# Altium project Mother_Board.PrjPcb
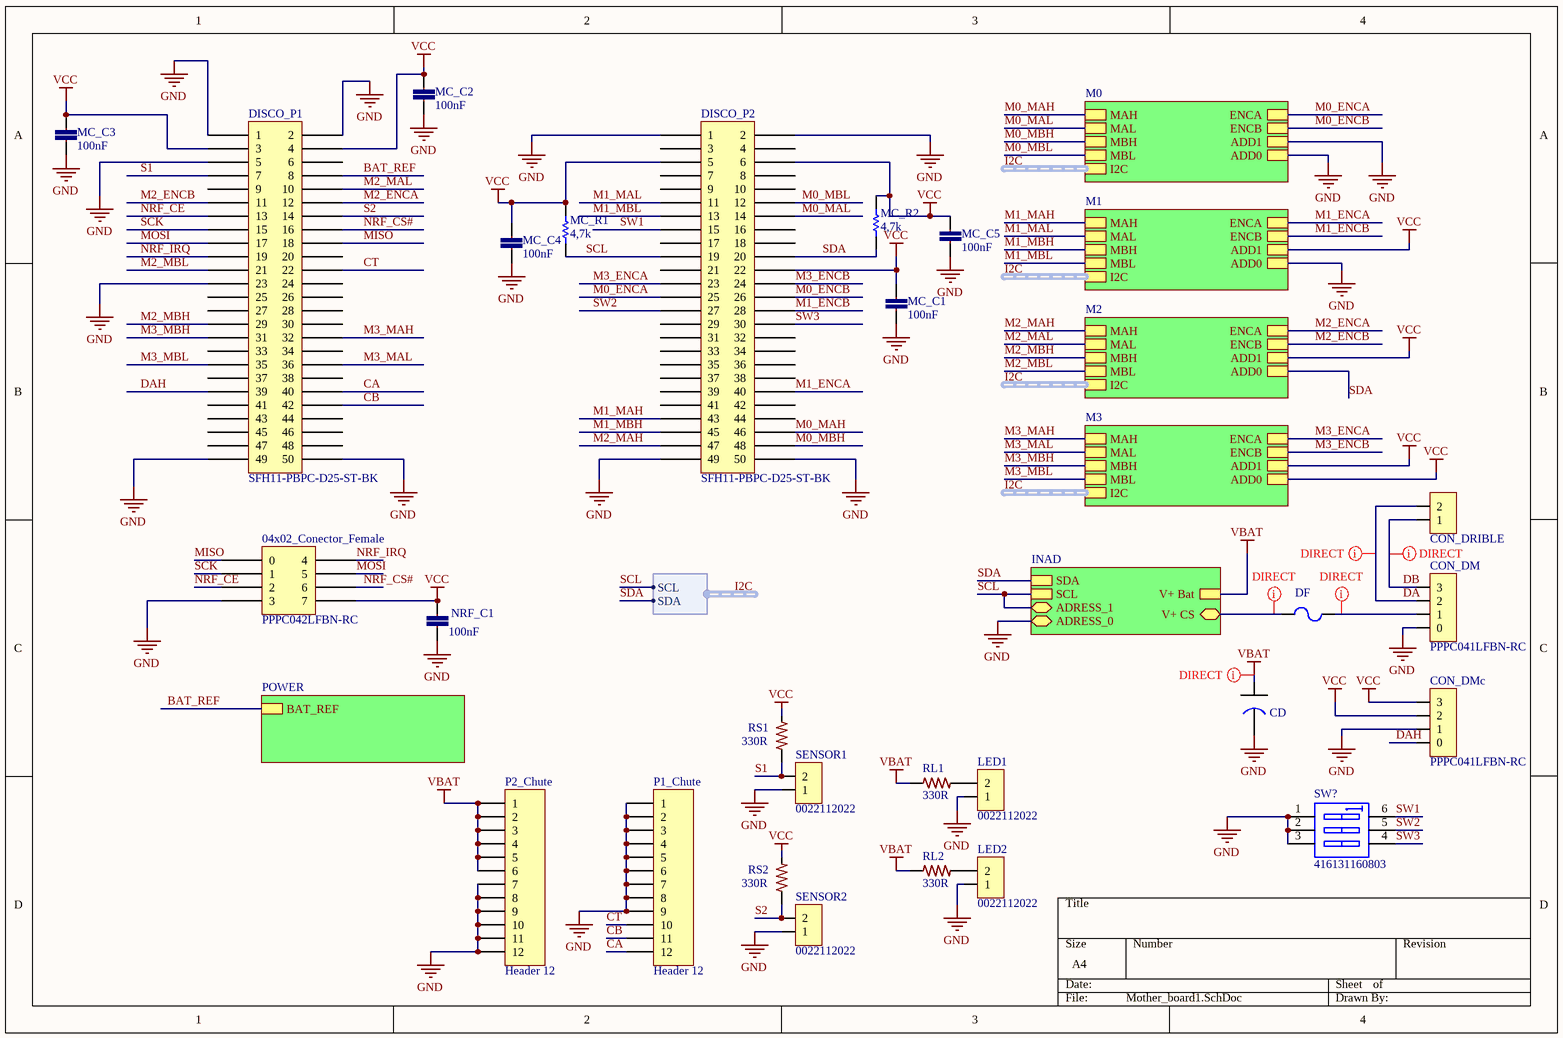
[diagram p0: Mother_board1.SchDoc]
4 sheets, 90 parts. Net scope: hierarchical (ports join the sheet entries above them; power ports are global).
Board file: Mother_board06.PcbDoc
Sheets:
  Mother_board1.SchDoc
    M0 = MOTORES.SchDoc
      INA = INA220.SchDoc
    POWER = POWER.SchDoc
    M1 = MOTORES.SchDoc
      INA = INA220.SchDoc
    M2 = MOTORES.SchDoc
      INA = INA220.SchDoc
    M3 = MOTORES.SchDoc
      INA = INA220.SchDoc
    INAD = INA220.SchDoc

## Sheet Mother_board1.SchDoc
size A4

### Parts
04x02_Conector_Female  PPPC042LFBN-RC  [04x02_Conector_Female]
CD  EEE-FK1C681GP  [EEE-FK1C681GP]  (value not drawn)
CON_DM  PPPC041LFBN-RC  [04x01_Conector_Female - duplicate]
CON_DMc  PPPC041LFBN-RC  [04x01_Conector_Female - duplicate]
CON_DRIBLE  0022112022  [02x01_Conector_Male]  (value not drawn)
DF  MF-MSMF250/16X  [RESC4632X16N]  (value not drawn)
DISCO_P1  SFH11-PBPC-D25-ST-BK  [25x02_Conector_Female]
DISCO_P2  SFH11-PBPC-D25-ST-BK  [25x02_Conector_Female]
LED1  0022112022  [02x01_Conector_Male]
LED2  0022112022  [02x01_Conector_Male]
MC_C1  100nF  [0402-CAP]
MC_C2  100nF  [0402-CAP]
MC_C3  100nF  [0402-CAP]
MC_C4  100nF  [0402-CAP]
MC_C5  100nF  [0402-CAP]
MC_R1  4,7k  [0402]
MC_R2  4,7k  [0402]
NRF_C1  100nF  [0402-CAP]
P1_Chute  Header 12  [HDR1X12]
P2_Chute  Header 12  [HDR1X12]
RL1  330R  [0402-RES-HD]
RL2  330R  [0402-RES-HD]
RS1  330R  [0402-RES-HD]
RS2  330R  [0402-RES-HD]
SENSOR1  0022112022  [02x01_Conector_Male]
SENSOR2  0022112022  [02x01_Conector_Male]
SW?  416131160803  [416131160803]

### Sub-sheets
INAD = INA220.SchDoc: V+ Bat, SDA, SCL, ADRESS_1, ADRESS_0, V+ CS
M0 = MOTORES.SchDoc: MBH, MAH, MBL, MAL, I2C (harness I2C), ENCA, ENCB, ADD1, ADD0
M1 = MOTORES.SchDoc: MBH, MAH, MBL, MAL, I2C (harness I2C), ENCA, ENCB, ADD1, ADD0
M2 = MOTORES.SchDoc: MBH, MAH, MBL, MAL, I2C (harness I2C), ENCA, ENCB, ADD1, ADD0
M3 = MOTORES.SchDoc: MBH, MAH, MBL, MAL, I2C (harness I2C), ENCA, ENCB, ADD1, ADD0
POWER = POWER.SchDoc: BAT_REF

### Harnesses
I2C: SCL, SDA

### Nets
GND: 04x02_Conector_Female.3 CD.2 CON_DM.0 CON_DMc.1 DISCO_P1.1 DISCO_P1.2 DISCO_P1.5 DISCO_P1.23 DISCO_P1.49 DISCO_P1.50 DISCO_P2.1 DISCO_P2.2 DISCO_P2.49 DISCO_P2.50 LED1.1 LED2.1 MC_C1.1 MC_C2.1 MC_C3.2 MC_C4.1 MC_C5.1 NRF_C1.2 P1_Chute.1 P1_Chute.2 P1_Chute.3 P1_Chute.4 P1_Chute.5 P1_Chute.6 P1_Chute.7 P1_Chute.8 P1_Chute.9 P2_Chute.7 P2_Chute.8 P2_Chute.9 P2_Chute.10 P2_Chute.11 P2_Chute.12 SENSOR1.1 SENSOR2.1 SW?.1 SW?.2 SW?.3 ; sheet M0/ADD1, sheet M0/ADD0, sheet M1/ADD0, sheet INAD/ADRESS_0
VBAT: CD.1 P2_Chute.1 P2_Chute.2 P2_Chute.3 P2_Chute.4 P2_Chute.5 P2_Chute.6 RL1.1 RL2.1 ; sheet INAD/V+ Bat  [project net V+ Bat]
VCC: 04x02_Conector_Female.7 CON_DMc.2 CON_DMc.3 DISCO_P1.3 DISCO_P1.4 DISCO_P2.5 DISCO_P2.6 DISCO_P2.22 MC_C1.2 MC_C2.2 MC_C3.1 MC_C4.2 MC_C5.2 MC_R1.2 MC_R2.2 NRF_C1.1 RS1.2 RS2.2 ; sheet M1/ADD1, sheet M2/ADD1, sheet M3/ADD1, sheet M3/ADD0
BAT_REF: DISCO_P1.8 ; sheet POWER/BAT_REF
CA: DISCO_P1.40 P1_Chute.12
CB: DISCO_P1.42 P1_Chute.11
CT: DISCO_P1.22 P1_Chute.10
DA: CON_DM.2 CON_DRIBLE.2
DAH: CON_DMc.0 DISCO_P1.39
DB: CON_DM.3 CON_DRIBLE.1
M0_ENCA: DISCO_P2.25 ; sheet M0/ENCA
M0_ENCB: DISCO_P2.26 ; sheet M0/ENCB
M0_MAH: DISCO_P2.46 ; sheet M0/MAH
M0_MAL: DISCO_P2.14 ; sheet M0/MAL
M0_MBH: DISCO_P2.48 ; sheet M0/MBH
M0_MBL: DISCO_P2.12 ; sheet M0/MBL
M1_ENCA: DISCO_P2.40 ; sheet M1/ENCA
M1_ENCB: DISCO_P2.28 ; sheet M1/ENCB
M1_MAH: DISCO_P2.43 ; sheet M1/MAH
M1_MAL: DISCO_P2.11 ; sheet M1/MAL
M1_MBH: DISCO_P2.45 ; sheet M1/MBH
M1_MBL: DISCO_P2.13 ; sheet M1/MBL
M2_ENCA: DISCO_P1.12 ; sheet M2/ENCA
M2_ENCB: DISCO_P1.11 ; sheet M2/ENCB
M2_MAH: DISCO_P2.47 ; sheet M2/MAH
M2_MAL: DISCO_P1.10 ; sheet M2/MAL
M2_MBH: DISCO_P1.29 ; sheet M2/MBH
M2_MBL: DISCO_P1.21 ; sheet M2/MBL
M3_ENCA: DISCO_P2.23 ; sheet M3/ENCA
M3_ENCB: DISCO_P2.24 ; sheet M3/ENCB
M3_MAH: DISCO_P1.32 ; sheet M3/MAH
M3_MAL: DISCO_P1.36 ; sheet M3/MAL
M3_MBH: DISCO_P1.31 ; sheet M3/MBH
M3_MBL: DISCO_P1.35 ; sheet M3/MBL
MISO: 04x02_Conector_Female.0 DISCO_P1.18
MOSI: 04x02_Conector_Female.5 DISCO_P1.17
NRF_CE: 04x02_Conector_Female.2 DISCO_P1.13
NRF_CS#: 04x02_Conector_Female.6 DISCO_P1.16
NRF_IRQ: 04x02_Conector_Female.4 DISCO_P1.19
S1: DISCO_P1.7 RS1.1 SENSOR1.2
S2: DISCO_P1.14 RS2.1 SENSOR2.2
SCK: 04x02_Conector_Female.1 DISCO_P1.15
SCL: DISCO_P2.19 MC_R1.1 ; sheet INAD/SCL, sheet INAD/ADRESS_1, sheet M0/I2C.SCL  [project net I2C.SCL]
SDA: DISCO_P2.20 MC_R2.1 ; sheet M2/ADD0, sheet INAD/SDA, sheet M0/I2C.SDA  [project net I2C.SDA]
SW1: DISCO_P2.15 SW?.6
SW2: DISCO_P2.27 SW?.5
SW3: DISCO_P2.30 SW?.4
NetCON_DM_1: CON_DM.1 DF.1
NetDF_2: DF.2 ; sheet INAD/V+ CS
NetLED1_2: LED1.2 RL1.2
NetLED2_2: LED2.2 RL2.2

Not connected (* = marked no-connect by the designer): DISCO_P1 6 9 20 24 25 26 27 28 30 33 34 37 38 41 43 44 45 46 47 48; DISCO_P2 3 4 7 8 9 10 16 17 18 21 29 31 32 33 34 35 36 37 38 39 41 42 44

### Buses and harness runs
harness I2C = sheet M0/I2C
harness I2C = sheet M1/I2C
harness I2C = sheet M2/I2C
harness I2C = sheet M3/I2C

### Layout directives
net class DIRECT: DA, DB, NetCON_DM_1, NetDF_2, V+ Bat

### Library data of the parts
04x02_Conector_Female = 04x02_Conector_Female: 8 Position Header Connector 0.100" (2.54mm) Through Hole Gold
CD = CAP AL 680UF/16V: Aluminum Electrolytic Capacitors - SMD Al Lytic Cap SMT FK Series 105C
CON_DM CON_DMc = 04x01_Conector_Female-SCH: 4 Position Header Connector 0.100" (2.54mm) Through Hole Gold
CON_DRIBLE LED1 LED2 SENSOR1 SENSOR2 = 02x01_Conector_Male: CONN HEADER 2POS .100 VERT GOLD
DF = MF-MSMF250/16X-01.A.1: PTC RESETTABLE .30A 30V 1812
DISCO_P1 DISCO_P2 = 25x02_Conector_Female: 50 Position Header Connector 0.100" (2.54mm) Through Hole Gold
MC_C1-MC_C5 NRF_C1 = CC0402-100nF-A.12: CAP CER 0.1UF 10V 20% X5R 0402; Part No: VJ0402V104ZXQPBC; Cod EMS: 05.281.006.133; Value: 100n
MC_R1 MC_R2 = Res1: Resistor; Published: 8-Jun-2000; LatestRevisionDate: 17-Jul-2002; LatestRevisionNote: Re-released for DXP Platform.; PackageReference: AXIAL-0.3; Publisher: Altium Limited; PackageDescription: Axial Device, Thru-Hole; 2 Leads; 0.3 in Pin Spacing; Value: 4,7K
P1_Chute P2_Chute = Header 12: Header, 12-Pin; LatestRevisionDate: 17-Jul-2002; LatestRevisionNote: Re-released for DXP Platform.; Publisher: Altium Limited
RL1 RL2 RS1 RS2 = R0402-330R-7: RES 330 OHM 1/10W 1% 0402 SMD; Part No: ERJ-2RKF3300X; Value: 330; Cod EMS: 05.280.029.506; Family Description: RESISTOR FILME ESPESSO 10R-1M / 1/10W / 1% / 0402. P/N: ERJ-2RKF....X – PANASONIC ELECTRONIC COMPONENTS.; Family: ERJ-2RKF....X
SW? = CMP-1433-00003-1: WS-DISV 1.27 mm small compact SMD Dip Switch with top tape; Manufacturer: Wuerth Elektronik; NoPins: 06; ComponentLink2Description: Datasheet; ComponentLink1URL: http://www.we-online.com; PackageReference: 416131160803; ComponentLink1Description: Manufacturer URL; PartNumber: 416131160803; ComponentLink2URL: http://katalog.we-online.de/em/datasheet/4161311608xx.pdf

## Sheet MOTORES.SchDoc
size A4
Used 4 times, as channels M0, M1, M2, M3. Parts and nets are listed once, with the designators drawn on the sheet.
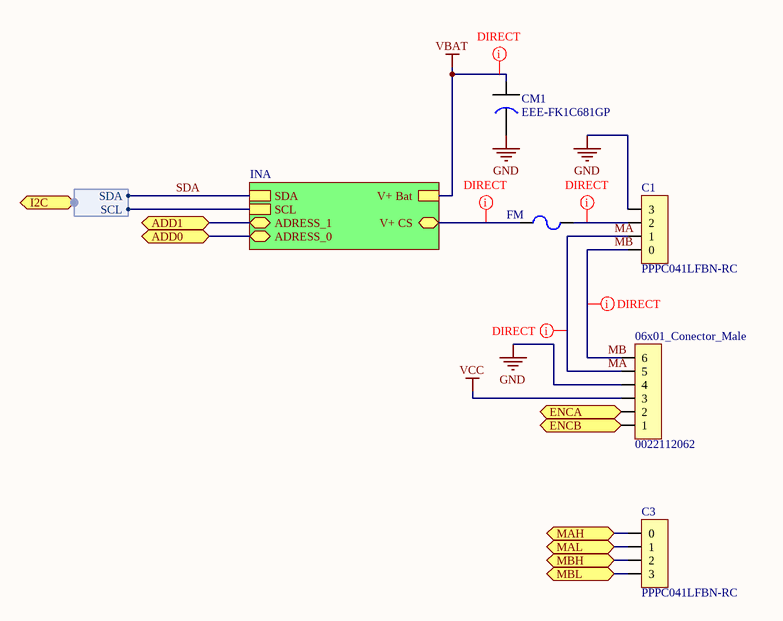
[diagram p1: MOTORES.SchDoc]

### Parts
06x01_Conector_Male  0022112062  [06x01_Conector_Male]
C1  PPPC041LFBN-RC  [04x01_Conector_Female]
C3  PPPC041LFBN-RC  [04x01_Conector_Female]
CM1  EEE-FK1C681GP  [EEE-FK1C681GP]
FM  MF-MSMF250/16X  [RESC4632X16N]  (value not drawn)

### Sub-sheets
INA = INA220.SchDoc: V+ Bat, SDA, SCL, ADRESS_1, ADRESS_0, V+ CS

### Ports
ADD0, ADD1, ENCA, ENCB, I2C (harness I2C), MAH, MAL, MBH, MBL

### Harnesses
I2C: SDA, SCL

### Nets
GND: 06x01_Conector_Male.4 C1.3 CM1.2
VBAT: CM1.1 ; sheet INA/V+ Bat
VCC: 06x01_Conector_Male.3
ADD0: port ADD0, sheet INA/ADRESS_0
ADD1: port ADD1, sheet INA/ADRESS_1
ENCA: 06x01_Conector_Male.2 ; port ENCA
ENCB: 06x01_Conector_Male.1 ; port ENCB
MA: 06x01_Conector_Male.5 C1.1
MAH: C3.0 ; port MAH
MAL: C3.1 ; port MAL
MB: 06x01_Conector_Male.6 C1.0
MBH: C3.2 ; port MBH
MBL: C3.3 ; port MBL
SDA: sheet INA/SDA, port I2C.SDA
NetC1_2: C1.2 FM.1
NetFM_2: FM.2 ; sheet INA/V+ CS
(unnamed): sheet INA/SCL, port I2C.SCL

### Channels
M0: designators end in _M0; ports ADD0=GND ADD1=GND ENCA=M0_ENCA ENCB=M0_ENCB MAH=M0_MAH MAL=M0_MAL MBH=M0_MBH MBL=M0_MBL
M1: designators end in _M1; ports ADD0=GND ADD1=VCC ENCA=M1_ENCA ENCB=M1_ENCB MAH=M1_MAH MAL=M1_MAL MBH=M1_MBH MBL=M1_MBL
M2: designators end in _M2; ports ADD0=I2C.SDA ADD1=VCC ENCA=M2_ENCA ENCB=M2_ENCB MAH=M2_MAH MAL=M2_MAL MBH=M2_MBH MBL=M2_MBL
M3: designators end in _M3; ports ADD0=VCC ADD1=VCC ENCA=M3_ENCA ENCB=M3_ENCB MAH=M3_MAH MAL=M3_MAL MBH=M3_MBH MBL=M3_MBL

### Layout directives
net class DIRECT: MA_M0, MB_M0, NetC1_M0_2, NetFM_M0_2, V+ Bat

### Library data of the parts
06x01_Conector_Male = 06x01_Conector_Male: CONN HEADER 6POS .100 VERT GOLD
C1 C3 = 04x01_Conector_Female-SCH: as CON_DM on sheet Mother_board1
CM1 = CAP AL 680UF/16V: as CD on sheet Mother_board1
FM = MF-MSMF250/16X-01.A.1: PTC RESETTABLE .30A 30V 1812

## Sheet INA220.SchDoc
size A4; Organization1: VINCULADA AO EXÉRCITO BRASILEIRO; Organization2: FÁBRICA DE MATERIAL DE; Organization3: COMUNICAÇÕES E ELETRÔNICA; Organization0: INDÚSTRIA DE MATERIAL BÉLICO DO BRASIL
Used 5 times, as channels M0/INA, M1/INA, M2/INA, M3/INA, INAD. Parts and nets are listed once, with the designators drawn on the sheet.
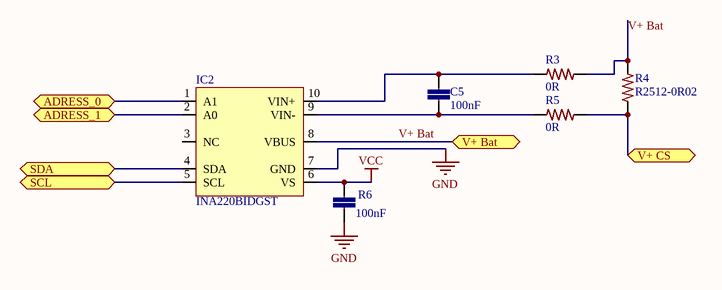
[diagram p2: INA220.SchDoc]

### Parts
C5  100nF  [0402-CAP]
IC2  INA220BIDGST  [TSSOP10]
R3  0R  [0402-RES-HD]
R4  R2512-0R02  [2512-RES-HD]
R5  0R  [0402-RES-HD]
R6  100nF  [0402-CAP]

### Ports
ADRESS_0, ADRESS_1, SCL, SDA, V+ Bat, V+ CS

### Nets
GND: IC2.7(GND) R6.2
VCC: IC2.6(VS) R6.1
ADRESS_0: IC2.1(A1) ; port ADRESS_0
ADRESS_1: IC2.2(A0) ; port ADRESS_1
SCL: IC2.5(SCL) ; port SCL
SDA: IC2.4(SDA) ; port SDA
V+ Bat: IC2.8(VBUS) R3.2 R4.2 ; port V+ Bat
V+ CS: R4.1 R5.2 ; port V+ CS
NetC5_1: C5.1 IC2.10(VIN+) R3.1
NetC5_2: C5.2 IC2.9(VIN-) R5.1

Not connected (* = marked no-connect by the designer): IC2 3(NC)

### Channels
M0/INA: designators end in _M0_INA; ports ADRESS_0=GND ADRESS_1=GND SCL=I2C.SCL SDA=I2C.SDA V+ Bat=V+ Bat V+ CS=NetFM_M0_2
M1/INA: designators end in _M1_INA; ports ADRESS_0=GND ADRESS_1=VCC SCL=I2C.SCL SDA=I2C.SDA V+ Bat=V+ Bat V+ CS=NetFM_M1_2
M2/INA: designators end in _M2_INA; ports ADRESS_0=I2C.SDA ADRESS_1=VCC SCL=I2C.SCL SDA=I2C.SDA V+ Bat=V+ Bat V+ CS=NetFM_M2_2
M3/INA: designators end in _M3_INA; ports ADRESS_0=VCC ADRESS_1=VCC SCL=I2C.SCL SDA=I2C.SDA V+ Bat=V+ Bat V+ CS=NetFM_M3_2
INAD: designators end in _INAD; ports ADRESS_0=GND ADRESS_1=I2C.SCL SCL=I2C.SCL SDA=I2C.SDA V+ Bat=V+ Bat V+ CS=NetDF_2

### Notes on the sheet
- USADO EQUIP.:
- DATA:
- ENG:
- HORA:
- APROV._______
- REV:
- TÍTULO:
- FOLHA:
- /
- FORMATO:
- A4
- CÓDIGO:
- ESTOQUE:

### Library data of the parts
C5 R6 = CC0402-100nF-A.12: as MC_C1 on sheet Mother_board1
IC2 = INA220BIDGST-3: IC MONITOR PWR/CURR BIDIR 10MSOP; Cod EMS: 05.284.001.527; Part No: INA220BIDGST
R3 R5 = R0402-0R-7: RES 0.0 OHM 1/16W JUMP 0402 SMD; Part No: CRCW04020000Z0ED; Cod EMS: 05.280.029.528; Value: 0
R4 = R2512-0R02-4: RES .02 OHM 2W 1% 2512 SMD; Part No: WSL2512R0200FEA18; Cod EMS: 05.280.029.529; Value: 0.02; Family Description: RESISTOR SENTIDO DE CORRENTE 0,010R-0,040R/ 2W / 1% / 2512 P/N: WSL2512.....FEA18 – VISHAY DALE.; Family: WSL2512.....FEA18

## Sheet POWER.SchDoc
size A4
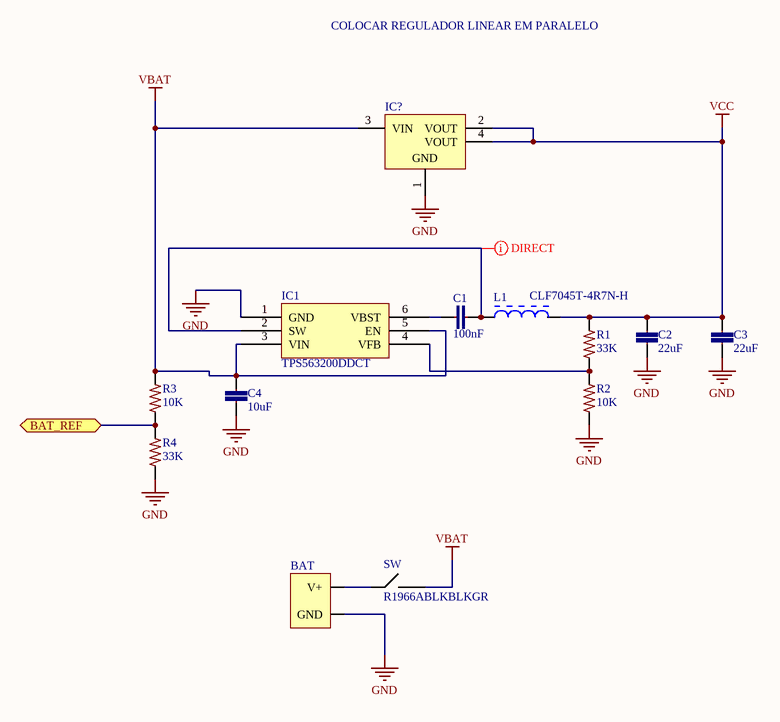
[diagram p3: POWER.SchDoc]

### Parts
BAT  XT60  [BATTERY_CONECTO-PCB]  (value not drawn)
C1  100nF  [0402-CAP]
C2  22uF  [1206-CAP]
C3  22uF  [1206-CAP]
C4  10uF  [1210-CAP]
IC1  TPS563200DDCT  [SOT95P280X110-6N]
IC?  LD1117S33CTR  [SOT-223_N]  (value not drawn)
L1  CLF7045T-4R7N-H  [CLF7045T]
R1  33K  [0402-RES-HD]
R2  10K  [0402-RES-HD]
R3  10K  [0402-RES-HD]
R4  33K  [0402-RES-HD]
SW  R1966ABLKBLKGR  [R1966AB-PCB]

### Ports
BAT_REF

### Nets
GND: BAT.1(GND) C2.1 C3.1 C4.1 IC1.1(GND) IC?.1(GND) R2.1 R4.1
VBAT: C4.2 IC1.3(VIN) IC1.5(EN) IC?.3(VIN) R3.2 SW.1  [project net V+ Bat]
VCC: C2.2 C3.2 IC?.2(VOUT) IC?.4(VOUT) L1.2 R1.2
BAT_REF: R3.1 R4.2 ; port BAT_REF
NetBAT_0: BAT.0(V+) SW.0
NetC1_1: C1.1 IC1.6(VBST)
NetC1_2: C1.2 IC1.2(SW) L1.1
NetIC1_4: IC1.4(VFB) R1.1 R2.2

### Layout directives
net class DIRECT: NetC1_2

### Notes on the sheet
- COLOCAR REGULADOR LINEAR EM PARALELO

### Library data of the parts
BAT = BATTERY_CONNECTOR: XT60 PRT-10474
C1 = CC0402-100nF-50v-A.3: CAP CER 0.1UF 50V 10% X7R 0402; Part No: C1005X7R1H104K050BB; Value: 100n; Cod EMS: 05.281.019.021
C2 C3 = CC1206-22uF-6.3V-1: CAP CER 22UF 6.3V 20% X5R 1206; Part No: C3216X5R0J226M085AC; Value: 22u; Rule: UNIONINDEX{}0[]RULEKIND{}PolygonConnect[]NETSCOPE{}AnyNet[]LAYERKIND{}SameLayer[]NAME{}Schematic Polygon Connect Style[]CONNECTSTYLE{}Direct[]RELIEFCONDUCTORWIDTH{}10mil[]RELIEFENTRIES{}4[]POLYGONRELIEFANGLE{}45 Angle[]AIRGAPWIDTH{}10mil[]UNIT{}Imperial[]PcbType{}ProtelPcb
C4 = CC1210-10uF-6: CAP CER 10UF 50V 20% X5R 1210; Part No: UMK325BJ106MM; value: 10u; Cod EMS: 05.281.019.522
IC1 = TPS563200DDCT-01.A.2: IC REG BUCK ADJ 3A SYNC 6SOT
IC? = CMP-0244-00307-1: Fixed Low Drop Positive Voltage Regulator, 3.3V, 4-Pin SOT-223, Tape and Reel; ComponentLink1URL: http://www.st.com; PackageVersion: 2010; ComponentLink1Description: Manufacturer URL; DatasheetVersion: 1/11/2011; ComponentLink2URL: http://www.st.com/internet/com/TECHNICAL_RESOURCES/TECHNICAL_LITERATURE/DATASHEET/CD00000544.pdf; PackageReference: SOT-223; ComponentLink2Description: Datasheet; PackageDescription: 4-Pin SOT-223 Package, 6.5 x 3.5 mm Body, 2.3 mm Pitch, 7 mm Lead Span
L1 = CLF7045T-4R7N-H-2: FIXED IND 4.7UH 4.1A 20 MOHM SMD; Family Description: INDUTORES FIXOS 7,2x6,9mm TDK CLF7045T -45 A 125oC; Rule: UNIONINDEX{}0[]RULEKIND{}PolygonConnect[]NETSCOPE{}AnyNet[]LAYERKIND{}SameLayer[]NAME{}Schematic Polygon Connect Style[]CONNECTSTYLE{}Direct[]RELIEFCONDUCTORWIDTH{}10mil[]RELIEFENTRIES{}4[]POLYGONRELIEFANGLE{}45 Angle[]AIRGAPWIDTH{}10mil[]UNIT{}Imperial[]PcbType{}ProtelPcb; Part No: CLF7045T-4R7N-H; Family: CLF7045T
R1 = R0402-33K-7: RES 33K OHM 1/10W 1% 0402 SMD; Part No: ERJ-2RKF3302X; Family Description: RESISTOR FILME ESPESSO 10R-1M / 1/10W / 1% / 0402. P/N: ERJ-2RKF....X – PANASONIC ELECTRONIC COMPONENTS.; Cod EMS: 05.280.029.535; Value: 33K; Family: ERJ-2RKF....X
R2 R3 = R0402-10K-10: RES 10K OHM 1/10W 1% 0402 SMD; Part No: ERJ-2RKF1002X; Cod EMS: 05.280.029.525; Family Description: RESISTOR FILME ESPESSO 10R-1M / 1/10W / 1% / 0402. P/N: ERJ-2RKF....X – PANASONIC ELECTRONIC COMPONENTS.; Value: 10K; Family: ERJ-2RKF....X
R4 = R0402-33K-7: RES 33K OHM 1/10W 1% 0402 SMD; Part No: ERJ-2RKF3302X; Cod EMS: 05.280.029.535; Family Description: RESISTOR FILME ESPESSO 10R-1M / 1/10W / 1% / 0402. P/N: ERJ-2RKF....X – PANASONIC ELECTRONIC COMPONENTS.; Value: 33K; Family: ERJ-2RKF....X
SW = Rocker Switch: SWITCH ROCKER SPST 15A 125V

## Nets that join several sheets
GND: Mother_board1 (42 pins), M0 (06x01_Conector_Male_M0.4 C1_M0.3 CM1_M0.2), M0/INA (IC2_M0_INA.1 IC2_M0_INA.2 IC2_M0_INA.7 R6_M0_INA.2), POWER (8 pins), M1 (06x01_Conector_Male_M1.4 C1_M1.3 CM1_M1.2), M1/INA (IC2_M1_INA.1 IC2_M1_INA.7 R6_M1_INA.2), M2 (06x01_Conector_Male_M2.4 C1_M2.3 CM1_M2.2), M2/INA (IC2_M2_INA.7 R6_M2_INA.2), M3 (06x01_Conector_Male_M3.4 C1_M3.3 CM1_M3.2), M3/INA (IC2_M3_INA.7 R6_M3_INA.2), INAD (IC2_INAD.1 IC2_INAD.7 R6_INAD.2)
V+ Bat: Mother_board1 (9 pins), M0 (CM1_M0.1), M0/INA (IC2_M0_INA.8 R3_M0_INA.2 R4_M0_INA.2), POWER (6 pins), M1 (CM1_M1.1), M1/INA (IC2_M1_INA.8 R3_M1_INA.2 R4_M1_INA.2), M2 (CM1_M2.1), M2/INA (IC2_M2_INA.8 R3_M2_INA.2 R4_M2_INA.2), M3 (CM1_M3.1), M3/INA (IC2_M3_INA.8 R3_M3_INA.2 R4_M3_INA.2), INAD (IC2_INAD.8 R3_INAD.2 R4_INAD.2)
VCC: Mother_board1 (18 pins), M0 (06x01_Conector_Male_M0.3), M0/INA (IC2_M0_INA.6 R6_M0_INA.1), POWER (6 pins), M1 (06x01_Conector_Male_M1.3), M1/INA (IC2_M1_INA.2 IC2_M1_INA.6 R6_M1_INA.1), M2 (06x01_Conector_Male_M2.3), M2/INA (IC2_M2_INA.2 IC2_M2_INA.6 R6_M2_INA.1), M3 (06x01_Conector_Male_M3.3), M3/INA (IC2_M3_INA.1 IC2_M3_INA.2 IC2_M3_INA.6 R6_M3_INA.1), INAD (IC2_INAD.6 R6_INAD.1)
BAT_REF: Mother_board1 (DISCO_P1.8), POWER (R3.1 R4.2)
I2C.SCL: Mother_board1 (DISCO_P2.19 MC_R1.1), M0/INA (IC2_M0_INA.5), M1/INA (IC2_M1_INA.5), M2/INA (IC2_M2_INA.5), M3/INA (IC2_M3_INA.5), INAD (IC2_INAD.2 IC2_INAD.5)
I2C.SDA: Mother_board1 (DISCO_P2.20 MC_R2.1), M0/INA (IC2_M0_INA.4), M1/INA (IC2_M1_INA.4), M2/INA (IC2_M2_INA.1 IC2_M2_INA.4), M3/INA (IC2_M3_INA.4), INAD (IC2_INAD.4)
M0_ENCA: Mother_board1 (DISCO_P2.25), M0 (06x01_Conector_Male_M0.2)
M0_ENCB: Mother_board1 (DISCO_P2.26), M0 (06x01_Conector_Male_M0.1)
M0_MAH: Mother_board1 (DISCO_P2.46), M0 (C3_M0.0)
M0_MAL: Mother_board1 (DISCO_P2.14), M0 (C3_M0.1)
M0_MBH: Mother_board1 (DISCO_P2.48), M0 (C3_M0.2)
M0_MBL: Mother_board1 (DISCO_P2.12), M0 (C3_M0.3)
M1_ENCA: Mother_board1 (DISCO_P2.40), M1 (06x01_Conector_Male_M1.2)
M1_ENCB: Mother_board1 (DISCO_P2.28), M1 (06x01_Conector_Male_M1.1)
M1_MAH: Mother_board1 (DISCO_P2.43), M1 (C3_M1.0)
M1_MAL: Mother_board1 (DISCO_P2.11), M1 (C3_M1.1)
M1_MBH: Mother_board1 (DISCO_P2.45), M1 (C3_M1.2)
M1_MBL: Mother_board1 (DISCO_P2.13), M1 (C3_M1.3)
M2_ENCA: Mother_board1 (DISCO_P1.12), M2 (06x01_Conector_Male_M2.2)
M2_ENCB: Mother_board1 (DISCO_P1.11), M2 (06x01_Conector_Male_M2.1)
M2_MAH: Mother_board1 (DISCO_P2.47), M2 (C3_M2.0)
M2_MAL: Mother_board1 (DISCO_P1.10), M2 (C3_M2.1)
M2_MBH: Mother_board1 (DISCO_P1.29), M2 (C3_M2.2)
M2_MBL: Mother_board1 (DISCO_P1.21), M2 (C3_M2.3)
M3_ENCA: Mother_board1 (DISCO_P2.23), M3 (06x01_Conector_Male_M3.2)
M3_ENCB: Mother_board1 (DISCO_P2.24), M3 (06x01_Conector_Male_M3.1)
M3_MAH: Mother_board1 (DISCO_P1.32), M3 (C3_M3.0)
M3_MAL: Mother_board1 (DISCO_P1.36), M3 (C3_M3.1)
M3_MBH: Mother_board1 (DISCO_P1.31), M3 (C3_M3.2)
M3_MBL: Mother_board1 (DISCO_P1.35), M3 (C3_M3.3)
NetDF_2: Mother_board1 (DF.2), INAD (R4_INAD.1 R5_INAD.2)
NetFM_M0_2: M0 (FM_M0.2), M0/INA (R4_M0_INA.1 R5_M0_INA.2)
NetFM_M1_2: M1 (FM_M1.2), M1/INA (R4_M1_INA.1 R5_M1_INA.2)
NetFM_M2_2: M2 (FM_M2.2), M2/INA (R4_M2_INA.1 R5_M2_INA.2)
NetFM_M3_2: M3 (FM_M3.2), M3/INA (R4_M3_INA.1 R5_M3_INA.2)

## Assembly variants
SMD: not fitted 04x02_Conector_Female 06x01_Conector_Male_M0 06x01_Conector_Male_M1 06x01_Conector_Male_M2 06x01_Conector_Male_M3 BAT C1 C1_M0 C1_M1 C1_M2 C1_M3 C3_M0 C3_M1 C3_M2 C3_M3 CD CM1_M0 CM1_M1 CM1_M2 CM1_M3 CON_DM CON_DMc CON_DRIBLE DISCO_P1 DISCO_P2 IC1 L1 LED1 LED2 MC_R1 MC_R2 P1_Chute P2_Chute R1 R2 SENSOR1 SENSOR2 SW SW?